# EAGLE design poi (EAGLE 8.0.1)
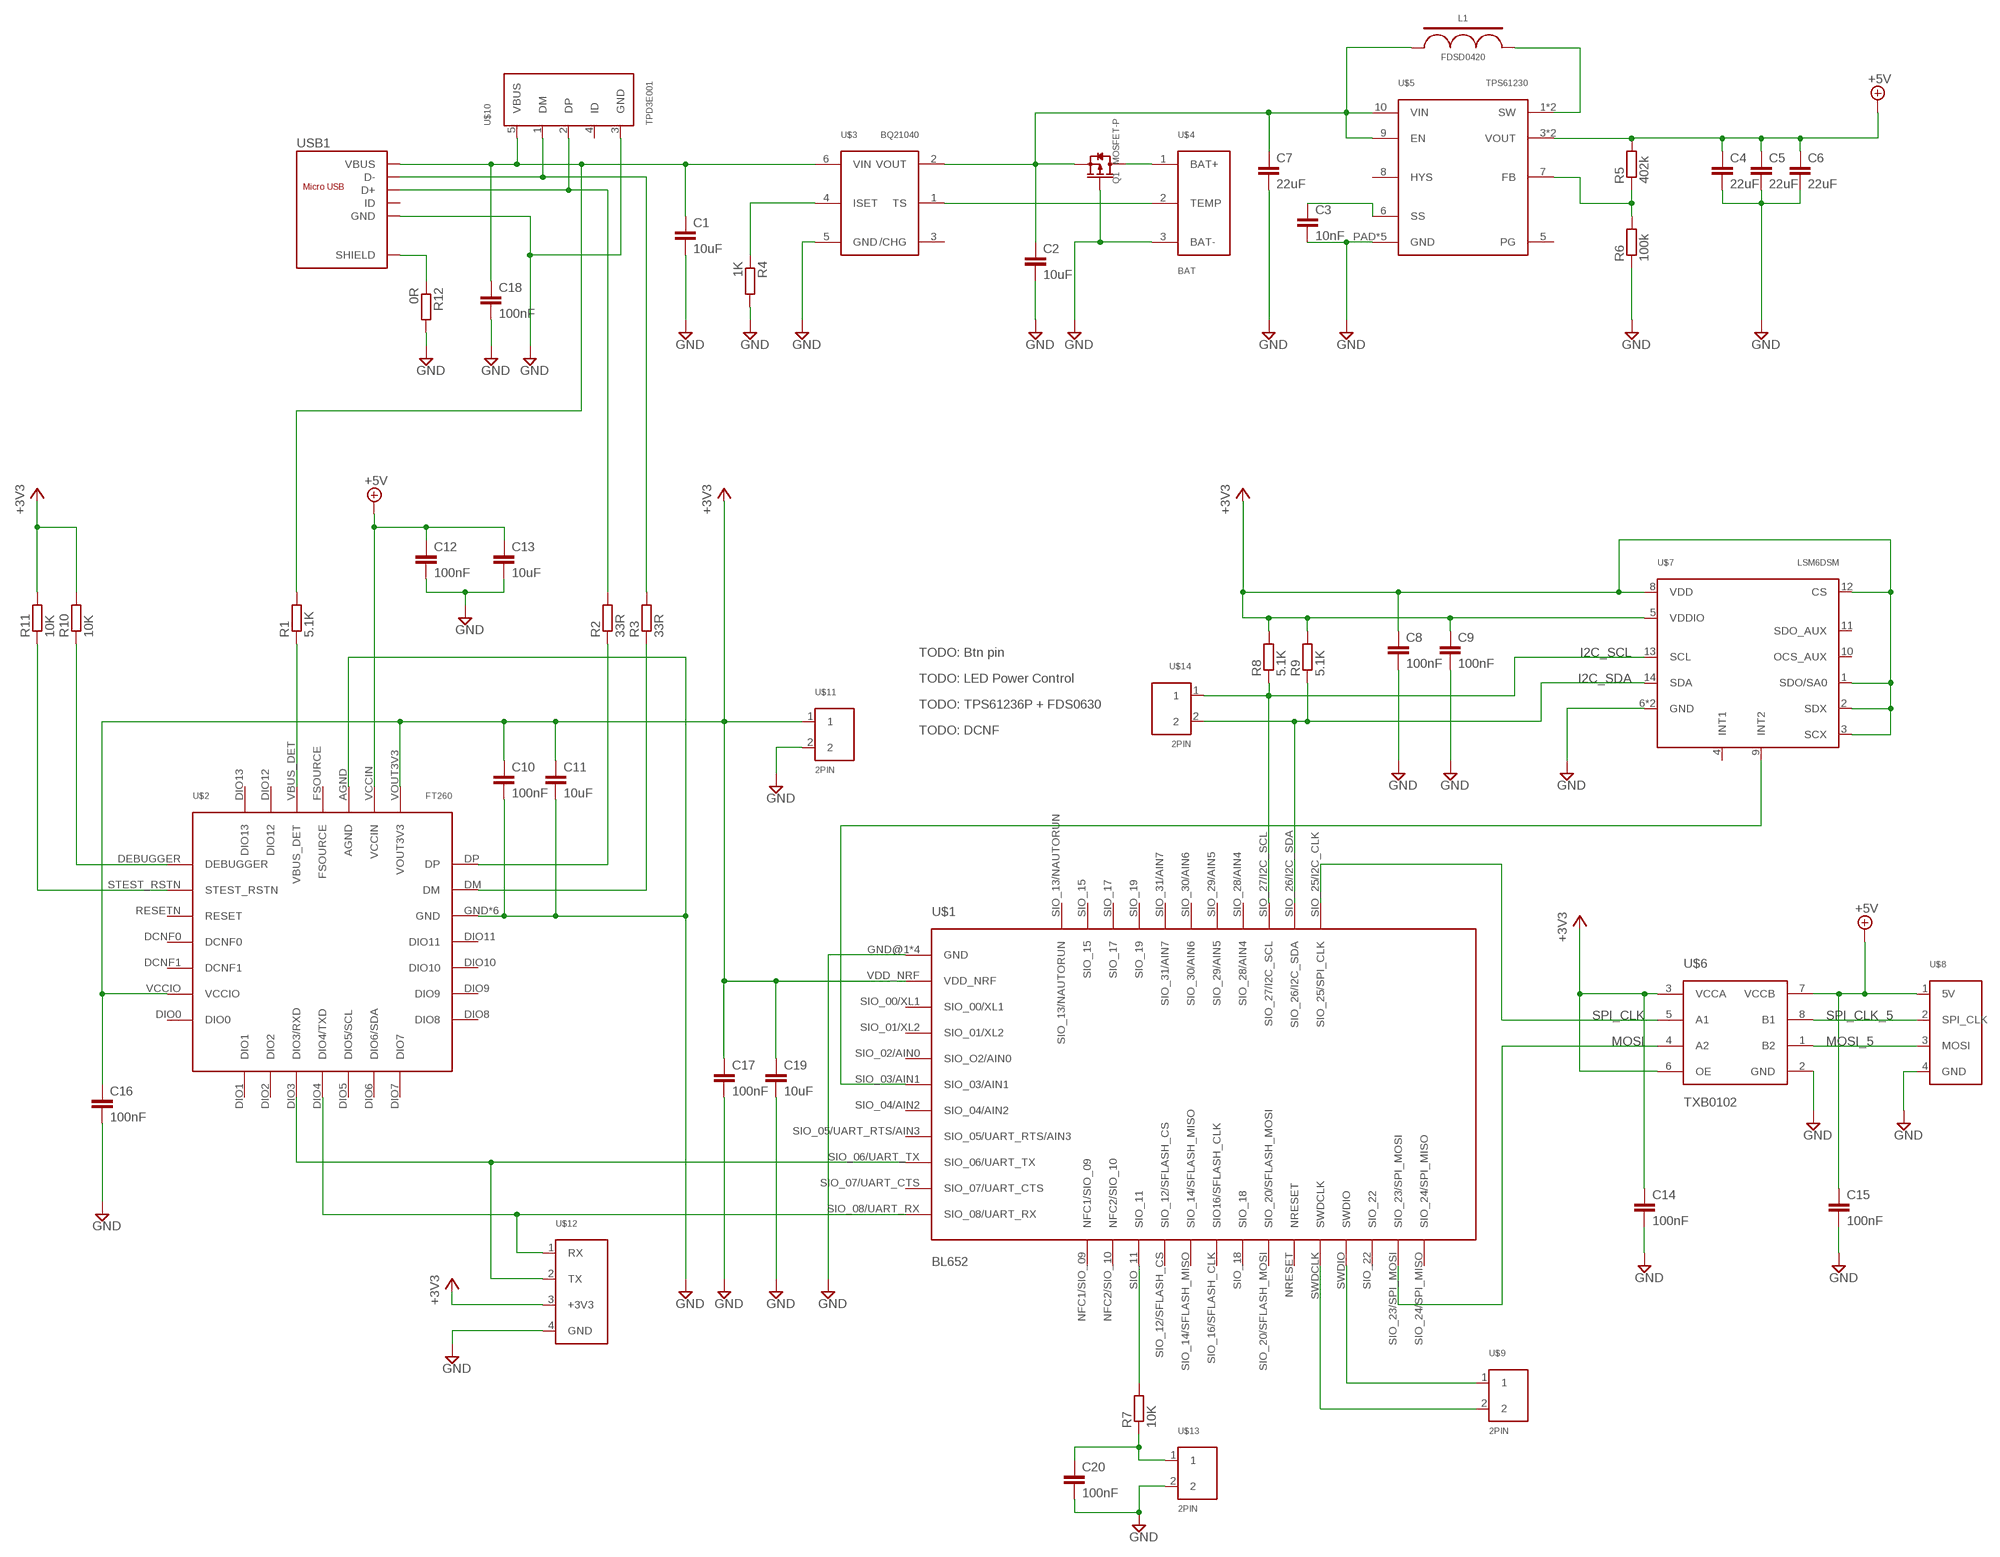
[diagram p0: schematic, sheet 1]

## Parts
C1  10uF  C-EUC0603  [C0603]
C2  10uF  C-EUC0603  [C0603]
C3  10nF  C-EUC0603  [C0603]
C4  22uF  C-EUC0603  [C0603]
C5  22uF  C-EUC0603  [C0603]
C6  22uF  C-EUC0603  [C0603]
C7  22uF  C-EUC0603  [C0603]
C8  100nF  C-EUC0603  [C0603]
C9  100nF  C-EUC0603  [C0603]
C10  100nF  C-EUC0603  [C0603]
C11  10uF  C-EUC0603  [C0603]
C12  100nF  C-EUC0603  [C0603]
C13  10uF  C-EUC0603  [C0603]
C14  100nF  C-EUC0603  [C0603]
C15  100nF  C-EUC0603  [C0603]
C16  100nF  C-EUC0603  [C0603]
C17  100nF  C-EUC0603  [C0603]
C18  100nF  C-EUC0603  [C0603]
C19  10uF  C-EUC0603  [C0603]
C20  100nF  C-EUC0603  [C0603]
L1  FDSD0420  [FDSD0420]
Q1  MOSFET-P  [SOT-23]
R1  5.1K  R-EU_R0603  [R0603]
R2  33R  R-EU_R0603  [R0603]
R3  33R  R-EU_R0603  [R0603]
R4  1K  R-EU_R0603  [R0603]
R5  402k  R-EU_R0603  [R0603]
R6  100k  R-EU_R0603  [R0603]
R7  10K  R-EU_R0603  [R0603]
R8  5.1K  R-EU_R0603  [R0603]
R9  5.1K  R-EU_R0603  [R0603]
R10  10K  R-EU_R0603  [R0603]
R11  10K  R-EU_R0603  [R0603]
R12  0R  R-EU_R0603  [R0603]
U$1  BL652  [BL652]
U$2  FT260  [WQFN-28]
U$3  BQ21040  [SOT23-6]
U$4  BAT  [3PIN]
U$5  TPS61230  [VSON-10]
U$6  TXB0102  [VSSOP-8]
U$7  LSM6DSM  [LGA-14L]
U$8  SPI-4PIN  [4PIN]
U$9  2PIN  [2PIN]
U$10  TPD3E001  [SOT-553]
U$11  2PIN  [2PIN]
U$12  UART-4PIN  [4PIN]
U$13  2PIN  [2PIN]
U$14  2PIN  [2PIN]
USB1  ZX62-B-5PA  [ZX62-B-5PA]

## Nets
+3V3: C8.1 C9.1 C10.1 C11.1 C14.1 C16.1 C17.1 C19.1 R8.2 R9.2 R10.2 R11.2 U$1.VDD_NRF U$2.VCCIO U$2.VOUT3V3 U$6.3(VCCA) U$6.6(OE) U$7.1(SDO/SA0) U$7.2(SDX) U$7.3(SCX) U$7.5(VDDIO) U$7.8(VDD) U$7.12(CS) U$11.1 U$12.3(+3V3)
+5V: C4.1 C5.1 C6.1 C12.1 C13.1 C15.1 R5.2 U$2.VCCIN U$5.3(VOUT) U$5.4(VOUT) U$6.7(VCCB) U$8.1(5V)
BT_RX: U$1.SIO_08/UART_RX U$2.DIO4(DIO4/TXD) U$12.1(RX)
BT_TX: U$1.SIO_06/UART_TX U$2.DIO3(DIO3/RXD) U$12.2(TX)
DEBUGGER: R10.1 U$2.DEBUGGER
FB: R5.1 R6.2 U$5.7(FB)
GND: C1.2 C2.2 C3.2 C4.2 C5.2 C6.2 C7.2 C8.2 C9.2 C10.2 C11.2 C12.2 C13.2 C14.2 C15.2 C16.2 C17.2 C18.2 C19.2 C20.2 Q1.1(G) R4.2 R6.1 R12.2 U$1.GND@1(GND) U$1.GND@2(GND) U$1.GND@3(GND) U$1.GND@4(GND) U$2.AGND U$2.GND U$2.PAD(GND) U$2.V1(GND) U$2.V2(GND) U$2.V3(GND) U$2.V4(GND) U$3.5(GND) U$4.3(BAT-) U$5.PAD(GND) U$5.V1(GND) U$5.V2(GND) U$5.V3(GND) U$5.V4(GND) U$6.2(GND) U$7.6(GND) U$7.7(GND) U$8.4(GND) U$10.3(GND) U$11.2 U$12.4(GND) U$13.2 USB1.5(GND)
I2C_SCL: R8.1 U$1.SIO_27/I2C_SCL U$7.13(SCL) U$14.1
I2C_SDA: R9.1 U$1.SIO_26/I2C_SDA U$7.14(SDA) U$14.2
INT2: U$1.SIO_03/AIN1 U$7.9(INT2)
ISET: R4.1 U$3.4(ISET)
MOSI: U$1.SIO_23/SPI_MOSI U$6.4(A2)
MOSI_5: U$6.1(B2) U$8.3(MOSI)
NTC: U$3.1(TS) U$4.2(TEMP)
PBIN: R7.2 U$1.SIO_11
PBOUT: C20.1 R7.1 U$13.1
SHIELD: R12.1 USB1.P1(SHIELD) USB1.P2(SHIELD) USB1.P3(SHIELD) USB1.P4(SHIELD) USB1.P5(SHIELD) USB1.P6(SHIELD)
SPI_CLK: U$1.SIO_25/I2C_CLK(SIO_25/SPI_CLK) U$6.5(A1)
SPI_CLK_5: U$6.8(B1) U$8.2(SPI_CLK)
SS: C3.1 U$5.6(SS)
STEST_RSTN: R11.1 U$2.STEST_RSTN
SW: L1.2 U$5.1(SW) U$5.2(SW)
SWDCLK: U$1.SWDCLK U$9.2
SWDIO: U$1.SWDIO U$9.1
USB_DM: R3.1 U$2.DM
USB_DM_OUT: R3.2 U$10.1(DM) USB1.2(D-)
USB_DP: R2.1 U$2.DP
USB_DP_OUT: R2.2 U$10.2(DP) USB1.3(D+)
VBAT: C2.1 C7.1 L1.1 Q1.2(S) U$3.2(VOUT) U$5.9(EN) U$5.10(VIN)
VBAT_RAW: Q1.3(D) U$4.1(BAT+)
VBUS: C1.1 C18.1 R1.2 U$3.6(VIN) U$10.5(VBUS) USB1.1(VBUS)
VBUS_DET: R1.1 U$2.VBUS_DET
Unconnected: U$1.NFC1/SIO_09 U$1.NFC2/SIO_10 U$1.NRESET U$1.SIO_00/XL1 U$1.SIO_01/XL2 U$1.SIO_02/AIN0(SIO_O2/AIN0) U$1.SIO_04/AIN2 U$1.SIO_05/UART_RTS/AIN3 U$1.SIO_07/UART_CTS U$1.SIO_12/SFLASH_CS U$1.SIO_13/NAUTORUN U$1.SIO_14/SFLASH_MISO U$1.SIO_15 U$1.SIO_16/SFLASH_CLK(SIO16/SFLASH_CLK) U$1.SIO_17 U$1.SIO_18 U$1.SIO_19 U$1.SIO_20/SFLASH_MOSI U$1.SIO_22 U$1.SIO_24/SPI_MISO U$1.SIO_28/AIN4 U$1.SIO_29/AIN5 U$1.SIO_30/AIN6 U$1.SIO_31/AIN7 U$2.DCNF0 U$2.DCNF1 U$2.DIO0 U$2.DIO1 U$2.DIO2 U$2.DIO5(DIO5/SCL) U$2.DIO6(DIO6/SDA) U$2.DIO7 U$2.DIO8 U$2.DIO9 U$2.DIO10 U$2.DIO11 U$2.DIO12 U$2.DIO13 U$2.FSOURCE U$2.RESETN(RESET) U$3.3(/CHG) U$5.5(PG) U$5.8(HYS) U$7.4(INT1) U$7.10(OCS_AUX) U$7.11(SDO_AUX) U$10.4(ID) USB1.4(ID)

## Notes on the sheet
- TODO: Btn pin
- TODO: LED Power Control
- TODO: TPS61236P + FDS0630
- TODO: DCNF

## Library data of the parts
C1-C20 = resistor:C-EU: CAPACITOR, European symbol
L1 = poi:FDSD0420
Q1 = Seeed-OPL-Transistor:MOSFET-P; MFN: NEXPERIA; MPN: PMV65XPEA; OC_FARNELL: 2498581
R1-R12 = resistor:R-EU_: RESISTOR, European symbol
U$1 = poi:BL652; MF: LAIRD; MPN: BL652-SA-01; OC_FARNELL: 2664536
U$2 = poi:FT260; MF: FTDI; MPN: FT260Q-T; OC_FARNELL: 2664512
U$3 = poi:BQ21040; MF: TEXAS INSTRUMENTS; MPN: BQ21040DBVT; OC_FARNELL: 2576287
U$4 = poi:BAT
U$5 = poi:TPS61230; MF: TEXAS INSTRUMENTS; MPN: TPS61230DRCR TPS61230DRCR; OC_FARNELL: 2425783
U$6 = poi:TXB0102; MF: TEXAS INSTRUMENTS; MPN: TXB0102DCUR; OC_FARNELL: 2295723
U$7 = poi:LSM6DSM
U$8 = poi:SPI-4PIN
U$9 U$11 U$13 U$14 = poi:2PIN
U$10 = poi:TPD3E001
U$12 = poi:UART-4PIN
USB1 = poi:ZX62-B-5PA: 320010005; MPN: ZX62-B-5PA

## Board
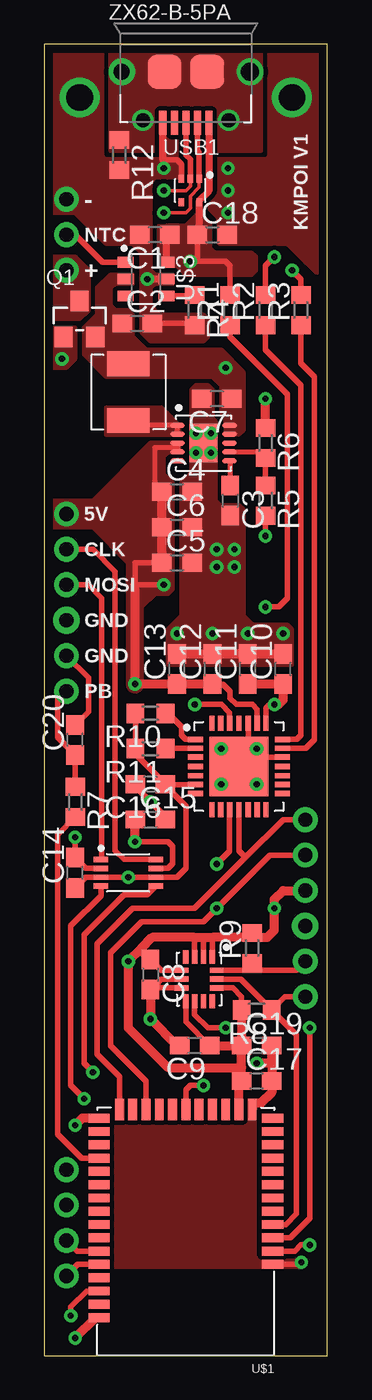
[diagram p1: board, top side]
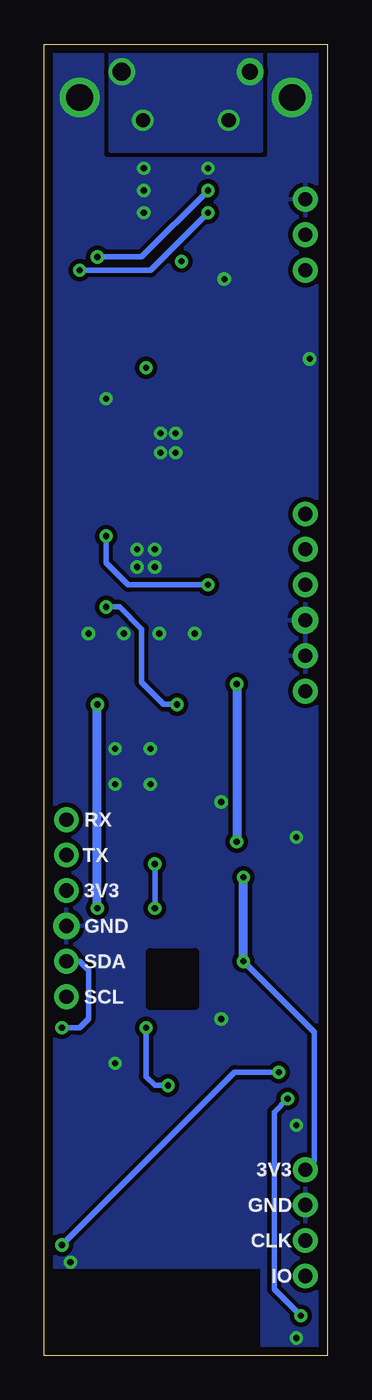
[diagram p2: board, bottom side, seen from below]

Size 16 x 74 mm. Coordinates in mm from the lower left corner, seen from the top.
Outline: 0,0 16,0 16,74 0,74 0,0
Copper layers (1*16): Top 0.035mm / dielectric 1.5mm / Bottom 0.035mm
Design rules "default *": minimum track width 0.2mm, minimum drill 0.35mm, track to track 0.2mm, track to pad 0.2mm, pad to pad 0.2mm, via to via 0.2mm, smd to smd 0.2mm, copper to edge 0.5mm, drill to drill 0.5mm, minimum pad ring 0.2mm, minimum via ring 0.2mm, stop-mask expansion 0.05mm, vias tented up to drill 0mil, thermal gap 0.25mm
bRestrict: area 7.5,19.8 to 10,22.8

### Footprints (pad centres in the part's own frame; a part is rotated, then mirrored left to right if it is on the bottom)
C0603 = smd 1.1 x 1: 1 -0.85,0; 2 0.85,0
FDSD0420 = smd 1.4 x 2.4: 1 -1.6,0; 2 1.6,0
SOT-23 = smd 1.016 x 1.143: 1 -0.889,-1.016; 2 0.889,-1.016; 3 0,1.016
R0603 = smd 1 x 1.1: 1 -0.85,0; 2 0.85,0
BL652 = smd 1.2 x 0.5: GND@1 4.9,4.85; GND@2 4.9,-6.4; GND@4 -4.9,1.85; NFC1/SIO_09 4.9,-5.65; NFC2/SIO_10 4.9,-4.9; NRESET 4.9,0.35; SIO_11 4.9,-4.15; SIO_12/SFLASH_CS 4.9,-3.4; SIO_13/NAUTORUN -4.9,-6.4; SIO_14/SFLASH_MISO 4.9,-2.65; SIO_15 -4.9,-5.65; SIO_16/SFLASH_CLK 4.9,-1.9; SIO_17 -4.9,-4.9; SIO_18 4.9,-1.15; SIO_19 -4.9,-4.15; SIO_20/SFLASH_MOSI 4.9,-0.4; SIO_22 4.9,2.6; SIO_23/SPI_MOSI 4.9,3.35; SIO_24/SPI_MISO 4.9,4.1; SIO_25/I2C_CLK -4.9,1.1; SIO_26/I2C_SDA -4.9,0.35; SIO_27/I2C_SCL -4.9,-0.4; SIO_28/AIN4 -4.9,-1.15; SIO_29/AIN5 -4.9,-1.9; SIO_30/AIN6 -4.9,-2.65; SIO_31/AIN7 -4.9,-3.4; SWDCLK 4.9,1.1; SWDIO 4.9,1.85 | smd 0.5 x 1.2: GND@3 -3.75,-6.9; SIO_00/XL1 -2.25,-6.9; SIO_01/XL2 -1.5,-6.9; SIO_02/AIN0 -0.75,-6.9; SIO_03/AIN1 0,-6.9; SIO_04/AIN2 0.75,-6.9; SIO_05/UART_RTS/AIN3 1.5,-6.9; SIO_06/UART_TX 2.25,-6.9; SIO_07/UART_CTS 3,-6.9; SIO_08/UART_RX 3.75,-6.9; VDD_NRF -3,-6.9
WQFN-28 = smd 0.3 x 0.85: AGND 0.525,2.45; DIO1 -1.525,-2.45; DIO2 -1.025,-2.45; DIO3 -0.525,-2.45; DIO4 0,-2.45; DIO5 0.525,-2.45; DIO6 1.025,-2.45; DIO7 1.525,-2.45; DIO12 -1.025,2.45; DIO13 -1.525,2.45; FSOURCE 0,2.45; VBUS_DET -0.525,2.45; VCCIN 1.025,2.45; VOUT3V3 1.525,2.45 | smd 0.85 x 0.3: DCNF0 -2.45,0; DCNF1 -2.45,-0.525; DEBUGGER -2.45,1.525; DIO0 -2.45,-1.525; DIO8 2.45,-1.525; DIO9 2.45,-1.025; DIO10 2.45,-0.525; DIO11 2.45,0; DM 2.45,1.025; DP 2.45,1.525; GND 2.45,0.525; RESETN -2.45,0.525; STEST_RSTN -2.45,1.025; VCCIO -2.45,-1.025 | smd 3.35 x 3.35: PAD 0,0 | drill 0.35 pad 0.75: V1 -1,1; V2 -1,-1; V3 1,-1; V4 1,1
SOT23-6 = smd 0.6 x 0.9: 1 -0.95,-1.15; 2 0,-1.15; 3 0.95,-1.15; 4 0.95,1.15; 5 0,1.15; 6 -0.95,1.15
3PIN = drill 0.8 pad 1.4: 1 -2,0; 2 0,0; 3 2,0
VSON-10 = smd 0.28 x 0.825: 1 -1,-1.462; 2 -0.5,-1.462; 3 0,-1.462; 4 0.5,-1.462; 5 1,-1.462; 6 1,1.462; 7 0.5,1.462; 8 0,1.462; 9 -0.5,1.462; 10 -1,1.462 | smd 2.15 x 1.6: PAD 0,0 | drill 0.35 pad 0.75: V1 -0.55,-0.425; V2 0.55,-0.425; V3 0.55,0.425; V4 -0.55,0.425
VSSOP-8 = smd 0.3 x 0.8: 1 -0.75,-1.55; 2 -0.25,-1.55; 3 0.25,-1.55; 4 0.75,-1.55; 5 0.75,1.55; 6 0.25,1.55; 7 -0.25,1.55; 8 -0.75,1.55
LGA-14L = smd 0.775 x 0.3: 1 -1.25,0.75; 2 -1.25,0.25; 3 -1.25,-0.25; 4 -1.25,-0.75; 8 1.25,-0.75; 9 1.25,-0.25; 10 1.25,0.25; 11 1.25,0.75 | smd 0.3 x 0.775: 5 -0.5,-1; 6 0,-1; 7 0.5,-1; 12 0.5,1; 13 0,1; 14 -0.5,1
4PIN = drill 0.8 pad 1.4: 1 -3,0; 2 -1,0; 3 1,0 | drill 0.8 pad 1.5: 4 3,0
2PIN = drill 0.8 pad 1.4: 1 -1,0; 2 1,0
SOT-553 = smd 0.3 x 0.45: 1 -0.5,-0.675; 2 0,-0.675; 3 0.5,-0.675; 4 0.5,0.675; 5 -0.5,0.675
ZX62-B-5PA = smd 0.4 x 1.35: 1 -1.3,2.875; 2 -0.65,2.875; 3 0,2.875; 4 0.65,2.875; 5 1.3,2.875 | smd 1.9 x 1.9: P1 -1.2,0; P2 1.2,0 | drill 1 pad 1.5: P3 -3.625,0 | drill 0.9 pad 1.5: P4 3.625,0 | drill 0.8: P5 -2.425,2.73; P6 2.425,2.73

### Placement (x,y rotation side)
C1  6.25,63.25 180 top
C2  5.25,58.25 0 top
C3  10.5,48.25 270 top
C4  7.5,48.75 0 top
C5  7.5,44.75 0 top
C6  7.5,46.75 0 top
C7  9.75,54 180 top
C8  6,21.5 270 top
C9  8.5,17.5 180 top
C10  13.5,38.75 90 top
C11  11.5,38.75 90 top
C12  9.5,38.75 90 top
C13  7.5,38.75 90 top
C14  1.75,27.25 90 top
C15  6,30.25 0 top
C16  6,32.25 180 top
C17  12,15.5 0 top
C18  9.5,63.25 0 top
C19  12,17.5 0 top
C20  1.75,34.75 90 top
L1  4.75,54.38 270 top
Q1  2,58.5 0 top
R1  10.5,59 90 top
R2  12.5,59 90 top
R3  14.5,59 90 top
R4  8.5,59 270 top
R5  12.5,48.25 270 top
R6  12.5,51.5 270 top
R7  1.75,31.25 270 top
R8  12,19.5 180 top
R9  11.75,23 90 top
R10  6,36.25 180 top
R11  6,34.25 180 top
R12  4.25,67.75 270 top
U$1  8,7 180 top
U$2  11,33.25 0 top
U$3  5.75,60.75 270 top
U$4  1.25,63.25 90 bottom
U$5  9,51.5 270 top
U$6  4.75,27.25 270 top
U$7  8.75,21.25 270 top
U$8  1.25,44.5 270 top
U$9  1.25,5.5 90 top
U$10  8.25,65.75 180 top
U$11  1.25,9.5 270 top
U$12  14.75,27.25 270 top
U$13  1.25,38.5 90 top
U$14  14.75,21.25 90 top
USB1  8,72.45 180 top

### Tracks (layer width: path | path; a pad name or v marks a point on that pad's centre or on a via)
+3V3  (via drill 0.35)
  Top 0.3: C8.1 6.6,21.75 U$7.5 | R10.2 R11.2 5.15,33.95 C16.1 | C14.1 2.35,27 U$6.3 v4.75,27 U$6.6 7.5,27 8,27.5 8,31 6.85,32.15 C16.1 | 11.75,23.75 R9.2 | 7.12,31.98 C16.1 | U$2.VCCIO 6.88,32.23 C16.1 | U$2.VOUT3V3 12.53,36.52 12.75,36.75 v13,36.75 | U$7.12 10.65,20.75 11.15,20.25 R8.2 | U$7.1 9.5,23.6 | U$7.2 9,23.6 | U$7.3 8.5,23.6 | U$7.8 8,18.85 C9.1
  Top 0.4: 11,15.5 C17.1
  Top 0.5: C11.1 C10.1 13.5,37 13.25,36.75 v13,36.75 | 5.5,23 v4.75,22.25 4.75,18.5 7,16.25 11.15,16.25 | 5.5,23 6.1,23.6 8.5,23.6 9,23.6 9.5,23.6 11.75,23.6 | U$12.3 13.5,26.25 13,25.75 v13,25.25 13,24 12.6,23.6 11.75,23.6 | C17.1 11.15,16.25 | 11.15,16.25 C19.1 | R8.2 C19.1 | C9.1 C19.1 | R9.2 11.75,23.6 | C8.1 5.5,22.85 5.5,23 | U$1.VDD_NRF 11,15.5
  Bottom 0.3: U$11.1 0.75,11 0.75,18.25 v4.75,22.25
  Bottom 0.5: v13,25.25 v13,36.75 | v4.75,22.25 v4.75,27
+5V  (via drill 0.35)
  Top 0.28: U$5.4 U$5.3 7.54,51.25 6.25,51.25 6.25,48.75 C4.1
  Top 0.3: R5.2 v12.5,46.25 | C5.1 5.12,44.75 5.12,43.5 v6.75,43.5 | U$2.VCCIN 12.03,36.48 11.75,36.75 10.85,36.75 10.5,37.1 10.5,37.5 10.1,37.9 C12.1 | U$6.7 7,27.5 7.25,27.75 7.25,28.75 7,29 v5.12,29 | 5.12,30.25 C15.1
  Top 0.5: C5.1 C6.1 C4.1 | C12.1 C13.1 v5.12,37.9 5.12,43.5 | v5.12,29 5.12,30.25
  Bottom 0.3: v6.75,43.5 11.25,43.5 12.5,44.75 v12.5,46.25
  Bottom 0.5: v5.12,37.9 v5.12,29
  pour Top (no thermals): 7.62,50.98 7.62,51.52 6.01,51.52 2.75,48.25 0.5,48.25 0.5,46.75 2.75,46.75 4.75,44.75 4.75,37.88 arc180 5.5,37.88 5.5,42.25 6.25,43 7,43 7.25,43.25 7.25,49.25 6.75,49.75 6.75,50.75 6.99,50.98
BT_RX
  Top 0.3: U$1.SIO_08/UART_RX 4.25,15.75 3,17 3,23.25 5,25.25 8.5,25.25 11.38,28.12 | 11.38,28.12 13.5,30.25 U$12.1 | U$2.DIO4 11,28.5 11.38,28.12
BT_TX  (via drill 0.35)
  Top 0.3: U$1.SIO_06/UART_TX 5.75,15.5 3.75,17.5 3.75,22.75 5.5,24.5 9,24.5 v9.75,25.25 12.75,28.25 U$12.2 | U$2.DIO3 10.47,28.48 v9.75,27.75
  Bottom 0.3: v9.75,27.75 v9.75,25.25
DEBUGGER
  Top 0.3: 6.85,36.15 R10.1 7,36.25 7.75,35.5 7.75,35 7.97,34.77 U$2.DEBUGGER
FB
  Top 0.28: U$5.7 12.5,51 R6.2
  Top 0.3: R6.2 R5.1
GND  (via drill 0.35, 1.5)
  Top 0.3: U$1.GND@4 14.4,5.15 v14.53,5.28 | U$7.6 6.6,21.25 6.42,21.07 | 6.42,21.07 C8.2 | v1.75,29.25 C14.2 2.35,27.5 U$6.2 | 6.7,67.47 7.5,67.47 7.75,67.22 U$10.3 | R4.2 8.5,58.25 C2.2 | C16.2 5.15,32.1 v6,31.25 6.85,30.4 C15.2 | U$7.7 6.42,20.75 6.42,21.07 | 11.53,33.77 11.53,33.25 U$2.PAD 12,33.25 U$2.V4 | 11.53,33.77 U$2.AGND | U$2.GND 11.53,33.77 | C20.2 2.5,36.35 2.5,38.25 U$13.2
  Top 0.4: U$3.5 v5.83,60.75 | 6.7,67.47 USB1.5
  Top 0.5: R6.1 v12.5,54 | U$1.GND@1 2.9,2.15 v1.75,1 | C8.2 v6,19 7.5,17.5 C9.2 | C10.2 C11.2 C12.2 C13.2 | U$1.GND@2 2.15,13.4 v1.75,13 | 12.85,16.5 C17.2 12.85,14.85 12.25,14.25 11.75,14.25 U$1.GND@3 | 12.85,16.5 C19.2 | 12.85,16.5 v12,16.5
  other vias: 9.75,45.5 9.75,44.5 10.75,45.5 10.75,44.5 10.38,64.5 6.75,67 2,71 14,71 7.5,40.75 9.5,40.75 11.5,40.75 13.5,40.75 1,56.25 10.38,67 10.38,65.75
  pour Bottom (isolate 0.25, rank 2): 0,0 3.67,0 3.67,5.03 16,5.03 16,74 0,74
  pour Top (no thermals): 9.25,54.75 8.57,54.75 8.32,54.5 8.32,52.5 9.68,52.5 9.68,52.73 9.5,52.9 9.5,54.5
  pour Top (no thermals): 9.68,50.5 9.68,48.25 9.93,48 11,48 11.25,47.75 11.25,41.75 11.75,41.25 7.25,41.25 7.75,41.75 7.75,49.25 8.32,49.83 8.32,50.5
  pour Top (no thermals): 6,62.75 6,61.25 6.25,61 7.25,61 7.25,60.5 6.25,60.5 6,60.25 6,59.25 6.5,58.75 9,58.75 9.25,58.5 9.25,57.5 9,57.25 6,57.25 5.5,57.75 5.5,62.25 5,62.75
  pour Top (isolate 0.25, rank 2, no thermals): 0,74 16,74 16,66.25 16.02,60.5 13.75,62.75 9.88,62.75 9.88,64 9.38,64.5 9.38,65 9.88,65.5 9.88,66.5 6.25,66.5 6,66.25 6,62.75 3.5,62.75 1.75,64.5 0,64.5
  pour Top (isolate 0.25, rank 2, no thermals): 14.5,5.03 14.5,5.5 11.88,5.5 11.88,13.75 3.75,13.75 3.75,5.03
  pour Top (no thermals): 7,41 7,39 14,39 14,41 13.75,41.25 7.25,41.25
  pour Top (no thermals): 0.5,58 1.75,58 1.75,56.25 1.25,55.75 0.5,55.75
I2C_SCL
  Top 0.3: U$1.SIO_27/I2C_SCL 13.65,7.4 14.25,8 14.25,18.1 R8.1 | U$7.13 11.1,21.25 R8.1 | U$14.1 13.6,20.25 R8.1
I2C_SDA  (via drill 0.35)
  Top 0.3: U$1.SIO_26/I2C_SDA 13.9,6.65 15,7.75 v15,18.5 | 11.75,21.75 U$7.14 | 11.75,21.75 14.25,21.75 U$14.2 | R9.1 11.75,21.75
  Bottom 0.3: U$14.2 14,22.25 13.5,21.75 13.5,19 14,18.5 v15,18.5
INT2  (via drill 0.35)
  Top 0.3: U$7.9 8.5,19.25 9.25,18.5 v10.25,18.5 | v9,15.25 8.25,15.25 8,15 U$1.SIO_03/AIN1
  Bottom 0.3: v10.25,18.5 10.25,15.75 9.75,15.25 v9,15.25
ISET
  Top 0.3: U$3.4 8.5,59.8 R4.1
MOSI  (via drill 0.35)
  Top 0.3: v2.25,14.5 1.5,15.25 1.5,24.25 3.2,25.95 U$6.4 | v1.5,2.25 1.5,2.75 2.4,3.65 U$1.SIO_23/SPI_MOSI
  Bottom 0.3: v2.25,14.5 3,13.75 3,3.75 v1.5,2.25
MOSI_5
  Top 0.3: U$6.1 3.25,28 3.25,42.75 2.5,43.5 U$8.3
NTC
  Top 0.3: U$4.2 1.75,63.25 3.3,61.7 U$3.1
PBIN
  Top 0.3: U$1.SIO_11 2.1,11.15 0.75,12.5 0.75,29.4 R7.2
PBOUT
  Top 0.3: U$13.1 0.75,37 0.75,34.9 C20.1 R7.1
SHIELD
  pour Top (isolate 0.25, no thermals): 3.75,74 12.25,74 12.25,68 3.75,68
  pour Bottom (no thermals): 3.75,74 12.25,74 12.25,68 3.75,68
SPI_CLK  (via drill 0.35)
  Top 0.3: U$1.SIO_25/I2C_CLK 14.15,5.9 14.5,6.25 v15,6.25 | v2.75,16 2.25,16.5 2.25,23.75 4.5,26 5.8,26 U$6.5
  Bottom 0.3: v15,6.25 5.25,16 v2.75,16
SPI_CLK_5
  Top 0.3: U$8.2 2.75,45.5 4,44.25 4,28.5 4.5,28 U$6.8
SS
  Top 0.28: U$5.6 10.5,50.5 C3.1
STEST_RSTN
  Top 0.3: U$2.STEST_RSTN 6.85,34.27 R11.1
SW
  Top 0.28: U$5.2 U$5.1 4.75,52.5 L1.2
  pour Top (no thermals): 6.62,53.5 7.62,52.5 7.62,51.98 3.5,51.98 3.5,53.5
SWDCLK
  Top 0.3: U$1.SWDCLK 1.85,5.9 U$9.2
SWDIO
  Top 0.3: U$1.SWDIO 1.9,5.15 U$9.1
USB_DM
  Top 0.3: R3.1 14.5,56 15.25,55.25 15.25,34.75 14.78,34.27 U$2.DM
USB_DM_OUT  (via drill 0.35)
  Top 0.2: v6.75,64.5 8,64.5 8.25,64.75 8.25,65.42 8.75,65.92 U$10.1
  Top 0.3: v14,61.25 14.5,60.75 R3.2 | U$10.1 8.75,67.9 8.65,68 USB1.2
  Bottom 0.3: v6.75,64.5 10,61.25 v14,61.25
USB_DP
  Top 0.3: U$2.DP 14.28,34.77 14.5,35 14.5,54.75 12.5,56.75 R2.1
USB_DP_OUT  (via drill 0.35)
  Top 0.2: v6.75,65.75 8,65.75 8.25,66 U$10.2
  Top 0.3: U$10.2 8.25,67.5 8,67.75 USB1.3 | v13,62 12.5,61.5 R2.2
  Bottom 0.3: v6.75,65.75 10.5,62 v13,62
VBAT  (via drill 0.35)
  Top 0.28: 10.75,52 U$5.9 | 10.75,52.5 U$5.10
  Top 0.3: 4.75,56 L1.1
  other vias: 10.25,55.75
  pour Top (no thermals): 5,61 5,60.5 4,60.5 3.75,60.25 3.75,59.25 4,59 4.75,59 5,58.75 5,57.5 6,56.5 6,55.25 3.5,55.25 2.25,56.5 2.25,58 3,58.75 3,60.25 3.75,61
  pour Top (no thermals): 3.5,56.75 3.5,55.25 9.5,55.25 10,54.75 10,53.25 10.25,53 10.26,51.98 11.01,51.98 11.25,52.23 11.25,55.5 10,56.75
VBAT_RAW
  pour Top (no thermals): 0.5,62 1.75,62 2.5,61.25 2.5,59 2,58.5 0.5,58.5
VBUS  (via drill 0.35)
  Top 0.3: R1.2 10.5,61.5 10.25,61.75 8.75,61.75 | 8.75,61.75 v8.25,61.75 | C18.1 8.65,61.85 8.75,61.75
  Top 0.4: USB1.1 9.3,65.72 8.75,65.17 U$10.5 8.75,63.25 C18.1 | U$3.6 6.9,63.25 C1.1
  pour Top (isolate 0.25, no thermals): 6.5,63.75 8,63.75 8.75,64.5 9.38,63.88 9.38,62.5 9.62,62.25 11.7,62.25 11.95,62 11.95,61.25 11.7,61 8,61 7.5,61.5 6.5,61.5
VBUS_DET  (via drill 0.35)
  Top 0.3: U$2.VBUS_DET 10.47,36.27 10,36.75 v8.5,36.75 | R1.1 10.5,57.5 13.75,54.25 13.75,42.75 13.25,42.25 v12.5,42.25
  Bottom 0.3: v8.5,36.75 9.25,36.75 10.5,38 10.5,41 11.75,42.25 v12.5,42.25

### Text on the board
tPlace: - | KMPOI V1 | NTC | + | 5V | CLK | MOSI | GND | GND | PB
bPlace: RX | TX | 3V3 | GND | SDA | SCL | 3V3 | GND | CLK | IO